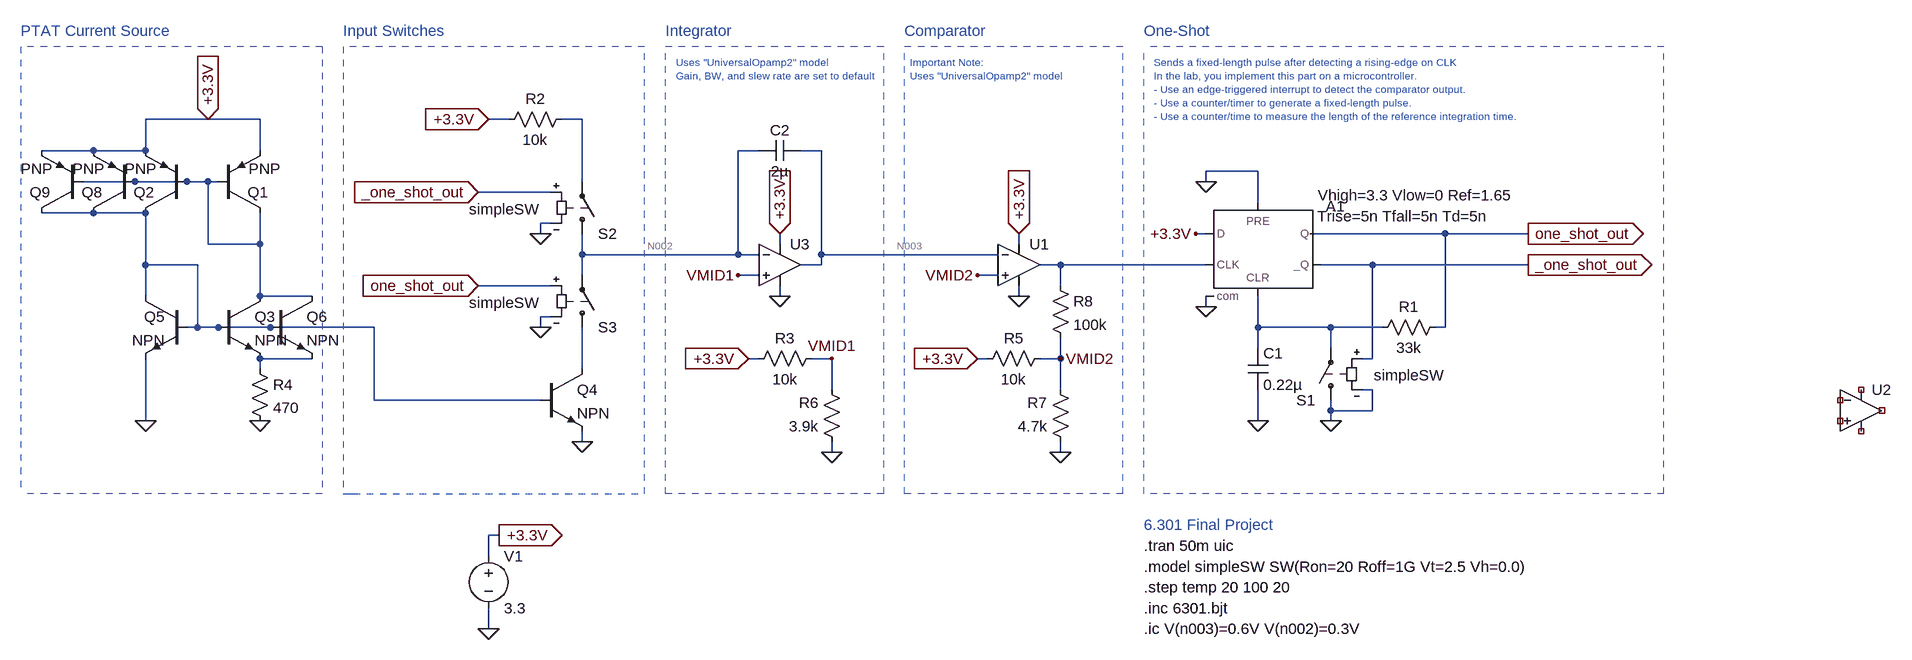
[diagram p0: schematic fp.asc]
fp.asc, the LTspice schematic file:
Version 4
SHEET 1 1244 856
WIRE -1392 -64 -1488 -64
WIRE -1312 -64 -1392 -64
WIRE -928 -64 -960 -64
WIRE -816 -64 -848 -64
WIRE -1568 -16 -1648 -16
WIRE -1488 -16 -1488 -64
WIRE -1488 -16 -1568 -16
WIRE -1312 -16 -1312 -64
WIRE -544 -16 -576 -16
WIRE -448 -16 -480 -16
WIRE 224 16 144 16
WIRE -1504 32 -1584 32
WIRE -1424 32 -1504 32
WIRE -1392 32 -1424 32
WIRE -1376 32 -1392 32
WIRE -816 32 -816 -64
WIRE 144 32 144 16
WIRE -864 48 -976 48
WIRE 224 64 224 16
WIRE -1568 80 -1648 80
WIRE -1488 80 -1568 80
WIRE -864 96 -880 96
WIRE -880 112 -880 96
WIRE 144 112 128 112
WIRE 512 112 304 112
WIRE 640 112 512 112
WIRE -1392 128 -1392 32
WIRE -1312 128 -1312 80
WIRE -1312 128 -1392 128
WIRE -512 128 -512 112
WIRE -144 128 -144 112
WIRE -816 144 -816 112
WIRE -576 144 -576 -16
WIRE -576 144 -816 144
WIRE -544 144 -576 144
WIRE -448 144 -448 -16
WIRE -176 144 -448 144
WIRE -1488 160 -1488 80
WIRE -1408 160 -1488 160
WIRE -448 160 -448 144
WIRE -448 160 -480 160
WIRE -80 160 -112 160
WIRE 144 160 -80 160
WIRE 400 160 320 160
WIRE 640 160 400 160
WIRE -816 176 -816 144
WIRE -544 176 -576 176
WIRE -176 176 -208 176
WIRE -864 192 -976 192
WIRE -80 192 -80 160
WIRE -1488 208 -1488 160
WIRE -1312 208 -1312 128
WIRE -1232 208 -1312 208
WIRE -512 208 -512 192
WIRE -144 208 -144 192
WIRE 144 224 144 208
WIRE -864 240 -880 240
WIRE -1408 256 -1408 160
WIRE -1408 256 -1424 256
WIRE -1376 256 -1408 256
WIRE -1296 256 -1376 256
WIRE -1136 256 -1296 256
WIRE -880 256 -880 240
WIRE 224 256 224 208
WIRE 336 256 224 256
WIRE 416 256 336 256
WIRE 512 256 512 112
WIRE 512 256 496 256
WIRE 224 288 224 256
WIRE 336 288 336 256
WIRE -1232 304 -1312 304
WIRE -544 304 -560 304
WIRE -432 304 -464 304
WIRE -192 304 -208 304
WIRE -80 304 -80 272
WIRE -80 304 -112 304
WIRE 400 304 400 160
WIRE 400 304 384 304
WIRE -1312 320 -1312 304
WIRE -816 320 -816 256
WIRE -432 352 -432 304
WIRE -80 352 -80 304
WIRE 400 352 384 352
WIRE -1136 368 -1136 256
WIRE -880 368 -1136 368
WIRE 336 384 336 368
WIRE 400 384 400 352
WIRE 400 384 336 384
WIRE -1488 400 -1488 304
WIRE 224 400 224 352
WIRE 336 400 336 384
WIRE -816 432 -816 416
WIRE -432 448 -432 432
WIRE -80 448 -80 432
WIRE -944 576 -960 576
WIRE -960 608 -960 576
WIRE -960 720 -960 688
FLAG 144 224 0
FLAG -960 720 0
FLAG -944 576 +3.3V
IOPIN -944 576 Out
FLAG 128 112 +3.3V
FLAG 224 400 0
FLAG 336 400 0
FLAG 640 112 one_shot_out
IOPIN 640 112 Out
FLAG 144 32 0
FLAG -144 112 +3.3V
IOPIN -144 112 In
FLAG -512 112 +3.3V
IOPIN -512 112 In
FLAG 640 160 _one_shot_out
IOPIN 640 160 Out
FLAG -880 112 0
FLAG -880 256 0
FLAG -976 192 one_shot_out
IOPIN -976 192 In
FLAG -976 48 _one_shot_out
IOPIN -976 48 In
FLAG -144 208 0
FLAG -512 208 0
FLAG -432 448 0
FLAG -432 304 VMID1
FLAG -576 176 VMID1
FLAG -208 176 VMID2
FLAG -560 304 +3.3V
IOPIN -560 304 In
FLAG -1312 400 0
FLAG -1488 400 0
FLAG -1392 -64 +3.3V
IOPIN -1392 -64 In
FLAG -960 -64 +3.3V
IOPIN -960 -64 In
FLAG -816 432 0
FLAG -80 448 0
FLAG -80 304 VMID2
FLAG -208 304 +3.3V
IOPIN -208 304 In
SYMBOL Digital\\dflop 224 64 R0
WINDOW 3 92 -11 Left 2
WINDOW 123 91 21 Left 2
SYMATTR Value Vhigh=3.3 Vlow=0 Ref=1.65
SYMATTR Value2 Trise=5n Tfall=5n Td=5n
SYMATTR InstName A1
SYMBOL voltage -960 592 R0
WINDOW 123 0 0 Left 2
WINDOW 39 0 0 Left 2
SYMATTR InstName V1
SYMATTR Value 3.3
SYMBOL res 512 240 R90
WINDOW 0 0 56 VBottom 2
WINDOW 3 32 56 VTop 2
SYMATTR InstName R1
SYMATTR Value 33k
SYMBOL cap 208 288 R0
SYMATTR InstName C1
SYMATTR Value 0.22µ
SYMBOL sw 336 384 R180
WINDOW 3 -174 54 Left 2
SYMATTR Value simpleSW
SYMATTR InstName S1
SYMBOL Opamps\\UniversalOpamp2 -144 160 R0
SYMATTR InstName U1
SYMBOL Opamps\\UniversalOpamp2 1152 384 R0
SYMATTR InstName U2
SYMBOL cap -480 -32 R90
WINDOW 0 0 32 VBottom 2
WINDOW 3 32 32 VTop 2
SYMATTR InstName C2
SYMATTR Value 2µ
SYMBOL res -944 -48 R270
WINDOW 0 32 56 VTop 2
WINDOW 3 0 56 VBottom 2
SYMATTR InstName R2
SYMATTR Value 10k
SYMBOL sw -816 128 M180
WINDOW 3 -174 54 Left 2
SYMATTR Value simpleSW
SYMATTR InstName S2
SYMBOL sw -816 272 M180
WINDOW 3 -174 54 Left 2
SYMATTR Value simpleSW
SYMATTR InstName S3
SYMBOL res -448 288 R90
WINDOW 0 0 56 VBottom 2
WINDOW 3 32 56 VTop 2
SYMATTR InstName R3
SYMATTR Value 10k
SYMBOL res -416 448 R180
WINDOW 0 36 76 Left 2
WINDOW 3 36 40 Left 2
SYMATTR InstName R6
SYMATTR Value 3.9k
SYMBOL pnp -1376 80 M180
WINDOW 0 45 32 Left 2
WINDOW 3 47 68 Left 2
SYMATTR InstName Q1
SYMBOL pnp -1424 80 R180
WINDOW 0 50 32 Left 2
WINDOW 3 47 68 Left 2
SYMATTR InstName Q2
SYMBOL npn -1376 208 R0
SYMATTR InstName Q3
SYMBOL npn -1424 208 M0
WINDOW 0 34 32 Left 2
WINDOW 3 34 68 Left 2
SYMATTR InstName Q5
SYMBOL pnp -1504 80 R180
WINDOW 0 50 32 Left 2
WINDOW 3 47 68 Left 2
SYMATTR InstName Q8
SYMBOL pnp -1584 80 R180
WINDOW 0 50 32 Left 2
WINDOW 3 47 68 Left 2
SYMATTR InstName Q9
SYMBOL npn -880 320 R0
SYMATTR InstName Q4
SYMBOL res -1328 304 R0
SYMATTR InstName R4
SYMATTR Value 470
SYMBOL res -96 288 R90
WINDOW 0 0 56 VBottom 2
WINDOW 3 32 56 VTop 2
SYMATTR InstName R5
SYMATTR Value 10k
SYMBOL res -64 448 R180
WINDOW 0 36 76 Left 2
WINDOW 3 36 40 Left 2
SYMATTR InstName R7
SYMATTR Value 4.7k
SYMBOL res -96 176 R0
SYMATTR InstName R8
SYMATTR Value 100k
SYMBOL npn -1296 208 R0
SYMATTR InstName Q6
SYMBOL Opamps\\UniversalOpamp2 -512 160 R0
SYMATTR InstName U3
TEXT 48 592 Left 2 !.tran 50m uic
TEXT 48 624 Left 2 !.model simpleSW SW(Ron=20 Roff=1G Vt=2.5 Vh=0.0)
TEXT -1184 -200 Left 2 ;Input Switches
TEXT -688 -200 Left 2 ;Integrator
TEXT -320 -200 Left 2 ;Comparator
TEXT 48 -200 Left 2 ;One-Shot
TEXT 64 -152 Left 1 ;Sends a fixed-length pulse after detecting a rising-edge on CLK\nIn the lab, you implement this part on a microcontroller.\n- Use an edge-triggered interrupt to detect the comparator output.\n- Use a counter/timer to generate a fixed-length pulse.\n- Use a counter/time to measure the length of the reference integration time.
TEXT -672 -152 Left 1 ;Uses "UniversalOpamp2" model\nGain, BW, and slew rate are set to default
TEXT -312 -152 Left 1 ;Important Note:\nUses "UniversalOpamp2" model
TEXT 48 560 Left 2 ;6.301 Final Project
TEXT 48 688 Left 2 !.inc 6301.bjt
TEXT 48 656 Left 2 !.step temp 20 100 20
TEXT -1680 -200 Left 2 ;PTAT Current Source
TEXT 48 720 Left 2 !.ic V(n003)=0.6V V(n002)=0.3V
LINE Normal -720 -176 -1184 -176 1
LINE Normal -720 512 -720 -176 1
LINE Normal -1168 512 -720 512 1
LINE Normal -1184 512 -1168 512 2
LINE Normal -1184 -176 -1184 512 1
LINE Normal -688 512 -688 -176 1
LINE Normal -352 512 -352 -176 1
LINE Normal -352 -176 -688 -176 1
LINE Normal -352 512 -688 512 1
LINE Normal -320 512 -320 -176 1
LINE Normal 16 512 16 -176 1
LINE Normal 48 512 48 -176 1
LINE Normal 848 512 848 -176 1
LINE Normal 848 -176 48 -176 1
LINE Normal 848 512 48 512 1
LINE Normal 16 -176 -320 -176 1
LINE Normal 16 512 -320 512 1
LINE Normal -1216 -176 -1216 512 1
LINE Normal -1216 -176 -1680 -176 1
LINE Normal -1216 512 -1680 512 1
LINE Normal -1680 -176 -1680 512 1

The netlist it stands for:
* fp.asc
A1 +3.3V 0 N006 0 N007 _one_shot_out one_shot_out 0 DFLOP Vhigh=3.3 Vlow=0 Ref=1.65 Trise=5n Tfall=5n Td=5n
V1 +3.3V 0 3.3
R1 one_shot_out N007 33k
C1 N007 0 0.22µ
S1 0 N007 _one_shot_out 0 simpleSW
XU1 VMID2 N003 +3.3V 0 N006 level.2 Avol=1Meg GBW=10Meg Slew=10Meg ilimit=25m rail=0 Vos=0 phimargin=45 en=0 enk=0 in=0 ink=0 Rin=500Meg  ; pins IN+ IN- V+ V- OUT
XU2 NC_01 NC_02 NC_03 NC_04 NC_05 level.2 Avol=1Meg GBW=10Meg Slew=10Meg ilimit=25m rail=0 Vos=0 phimargin=45 en=0 enk=0 in=0 ink=0 Rin=500Meg  ; pins IN+ IN- V+ V- OUT
C2 N003 N002 2µ
R2 +3.3V N001 10k
S2 N002 N001 _one_shot_out 0 simpleSW
S3 N009 N002 one_shot_out 0 simpleSW
R3 VMID1 +3.3V 10k
R6 0 VMID1 3.9k
Q1 N004 N004 +3.3V 0 PNP
Q2 N005 N004 +3.3V 0 PNP
Q3 N004 N005 N008 0 NPN
Q5 N005 N005 0 0 NPN
Q8 N005 N004 +3.3V 0 PNP
Q9 N005 N004 +3.3V 0 PNP
Q4 N009 N005 0 0 NPN
R4 N008 0 470
R5 VMID2 +3.3V 10k
R7 0 VMID2 4.7k
R8 N006 VMID2 100k
Q6 N004 N005 N008 0 NPN
XU3 VMID1 N002 +3.3V 0 N003 level.2 Avol=1Meg GBW=10Meg Slew=10Meg ilimit=25m rail=0 Vos=0 phimargin=45 en=0 enk=0 in=0 ink=0 Rin=500Meg  ; pins IN+ IN- V+ V- OUT
.model NPN NPN
.model PNP PNP
.lib standard.bjt
.tran 50m uic
.model simpleSW SW(Ron=20 Roff=1G Vt=2.5 Vh=0.0)
* Input Switches
* Integrator
* Comparator
* One-Shot
* Sends a fixed-length pulse after detecting a rising-edge on CLK
* In the lab, you implement this part on a microcontroller.
* - Use an edge-triggered interrupt to detect the comparator output.
* - Use a counter/timer to generate a fixed-length pulse.
* - Use a counter/time to measure the length of the reference integration time.
* Uses "UniversalOpamp2" model
* Gain, BW, and slew rate are set to default
* Important Note:
* Uses "UniversalOpamp2" model
* 6.301 Final Project
.inc 6301.bjt
.step temp 20 100 20
* PTAT Current Source
.ic V(n003)=0.6V V(n002)=0.3V
.lib UniversalOpamps2.sub
.backanno
.end